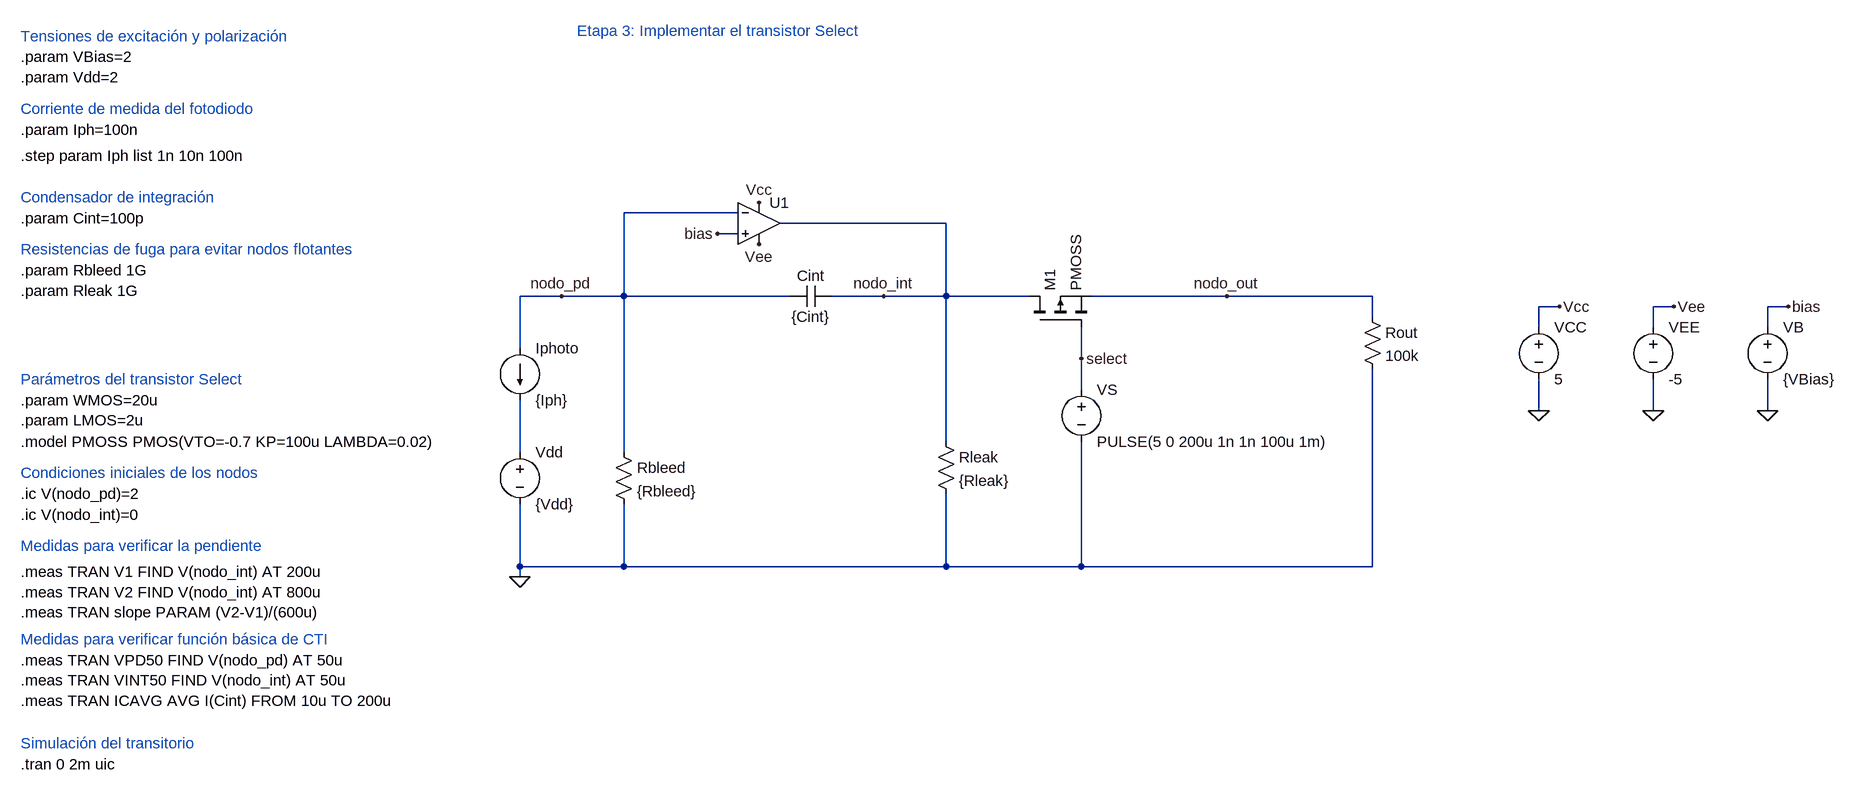
[diagram p0: schematic CTI_Etapa3.asc]
CTI_Etapa3.asc, the LTspice schematic file:
Version 4.1
SHEET 1 2360 1408
WIRE 416 384 240 384
WIRE 736 400 480 400
WIRE 416 416 384 416
WIRE 144 512 80 512
WIRE 240 512 240 384
WIRE 240 512 144 512
WIRE 496 512 240 512
WIRE 640 512 560 512
WIRE 736 512 736 400
WIRE 736 512 640 512
WIRE 864 512 736 512
WIRE 1168 512 960 512
WIRE 1392 512 1168 512
WIRE 1680 528 1648 528
WIRE 1856 528 1824 528
WIRE 2032 528 2000 528
WIRE 1392 544 1392 512
WIRE 1648 560 1648 528
WIRE 1824 560 1824 528
WIRE 2000 560 2000 528
WIRE 80 592 80 512
WIRE 944 608 944 560
WIRE 944 656 944 608
WIRE 1648 688 1648 640
WIRE 1824 688 1824 640
WIRE 2000 688 2000 640
WIRE 736 736 736 512
WIRE 80 752 80 672
WIRE 240 752 240 512
WIRE 80 928 80 832
WIRE 240 928 240 832
WIRE 240 928 80 928
WIRE 736 928 736 816
WIRE 736 928 240 928
WIRE 944 928 944 736
WIRE 944 928 736 928
WIRE 1392 928 1392 624
WIRE 1392 928 944 928
WIRE 80 944 80 928
FLAG 80 944 0
FLAG 144 512 nodo_pd
FLAG 640 512 nodo_int
FLAG 2032 528 bias
FLAG 1648 688 0
FLAG 1824 688 0
FLAG 1680 528 Vcc
FLAG 1856 528 Vee
FLAG 448 368 Vcc
FLAG 448 432 Vee
FLAG 384 416 bias
FLAG 2000 688 0
FLAG 944 608 select
FLAG 1168 512 nodo_out
SYMBOL voltage 2000 544 R0
SYMATTR InstName VB
SYMATTR Value {VBias}
SYMBOL current 80 592 R0
SYMATTR InstName Iphoto
SYMATTR Value {Iph}
SYMBOL cap 496 528 R270
WINDOW 0 32 32 VTop 2
WINDOW 3 0 32 VBottom 2
SYMATTR InstName Cint
SYMATTR Value {Cint}
SYMBOL res 224 736 R0
SYMATTR InstName Rbleed
SYMATTR Value {Rbleed}
SYMBOL res 720 720 R0
SYMATTR InstName Rleak
SYMATTR Value {Rleak}
SYMBOL voltage 80 736 R0
SYMATTR InstName Vdd
SYMATTR Value {Vdd}
SYMBOL OpAmps\\UniversalOpAmp2 448 400 R0
SYMATTR InstName U1
SYMBOL voltage 1648 544 R0
SYMATTR InstName VCC
SYMATTR Value 5
SYMBOL voltage 1824 544 R0
SYMATTR InstName VEE
SYMATTR Value -5
SYMBOL pmos 864 560 R270
SYMATTR InstName M1
SYMATTR Value PMOSS
SYMATTR SpiceLine L={LMOS} W={WMOS}
SYMBOL voltage 944 640 R0
SYMATTR InstName VS
SYMATTR Value PULSE(5 0 200u 1n 1n 100u 1m)
SYMBOL res 1376 528 R0
SYMATTR InstName Rout
SYMATTR Value 100k
TEXT 168 104 Left 2 ;Etapa 3: Implementar el transistor Select
TEXT -688 112 Left 2 ;Tensiones de excitación y polarización
TEXT -688 144 Left 2 !.param VBias=2\n.param Vdd=2
TEXT -688 224 Left 2 ;Corriente de medida del fotodiodo
TEXT -688 256 Left 2 !.param Iph=100n
TEXT -688 360 Left 2 ;Condensador de integración
TEXT -688 392 Left 2 !.param Cint=100p
TEXT -688 1232 Left 2 !.tran 0 2m uic
TEXT -688 1200 Left 2 ;Simulación del transitorio
TEXT -688 296 Left 2 !.step param Iph list 1n 10n 100n
TEXT -688 896 Left 2 ;Medidas para verificar la pendiente
TEXT -688 936 Left 2 !.meas TRAN V1 FIND V(nodo_int) AT 200u\n.meas TRAN V2 FIND V(nodo_int) AT 800u\n.meas TRAN slope PARAM (V2-V1)/(600u)
TEXT -688 440 Left 2 ;Resistencias de fuga para evitar nodos flotantes
TEXT -688 472 Left 2 !.param Rbleed 1G
TEXT -688 504 Left 2 !.param Rleak 1G
TEXT -688 736 Left 2 !.model PMOSS PMOS(VTO=-0.7 KP=100u LAMBDA=0.02)
TEXT -688 672 Left 2 !.param WMOS=20u\n.param LMOS=2u
TEXT -688 640 Left 2 ;Parámetros del transistor Select
TEXT -688 1040 Left 2 ;Medidas para verificar función básica de CTI
TEXT -688 1072 Left 2 !.meas TRAN VPD50 FIND V(nodo_pd) AT 50u\n.meas TRAN VINT50 FIND V(nodo_int) AT 50u\n.meas TRAN ICAVG AVG I(Cint) FROM 10u TO 200u
TEXT -688 784 Left 2 ;Condiciones iniciales de los nodos
TEXT -688 816 Left 2 !.ic V(nodo_pd)=2
TEXT -688 848 Left 2 !.ic V(nodo_int)=0

The netlist it stands for:
* CTI_Etapa3.asc
VB bias 0 {VBias}
Iphoto nodo_pd N001 {Iph}
Cint nodo_pd nodo_int {Cint}
Rbleed nodo_pd 0 {Rbleed}
Rleak nodo_int 0 {Rleak}
Vdd N001 0 {Vdd}
X§U1 bias nodo_pd Vcc Vee nodo_int level2 Avol=1Meg GBW=10Meg Slew=10Meg Ilimit=25m Rail=0 Vos=0 En=0 Enk=0 In=0 Ink=0 Rin=500Meg  ; pins In+ In- V+ V- OUT
VCC Vcc 0 5
VEE Vee 0 -5
M1 nodo_int select nodo_out nodo_out PMOSS L={LMOS} W={WMOS}
VS select 0 PULSE(5 0 200u 1n 1n 100u 1m)
Rout nodo_out 0 100k
.model NMOS NMOS
.model PMOS PMOS
.lib standard.mos
* Etapa 3: Implementar el transistor Select
* Tensiones de excitación y polarización
.param VBias=2
.param Vdd=2
* Corriente de medida del fotodiodo
.param Iph=100n
* Condensador de integración
.param Cint=100p
.tran 0 2m uic
* Simulación del transitorio
.step param Iph list 1n 10n 100n
* Medidas para verificar la pendiente
.meas TRAN V1 FIND V(nodo_int) AT 200u
.meas TRAN V2 FIND V(nodo_int) AT 800u
.meas TRAN slope PARAM (V2-V1)/(600u)
* Resistencias de fuga para evitar nodos flotantes
.param Rbleed 1G
.param Rleak 1G
.model PMOSS PMOS(VTO=-0.7 KP=100u LAMBDA=0.02)
.param WMOS=20u
.param LMOS=2u
* Parámetros del transistor Select
* Medidas para verificar función básica de CTI
.meas TRAN VPD50 FIND V(nodo_pd) AT 50u
.meas TRAN VINT50 FIND V(nodo_int) AT 50u
.meas TRAN ICAVG AVG I(Cint) FROM 10u TO 200u
* Condiciones iniciales de los nodos
.ic V(nodo_pd)=2
.ic V(nodo_int)=0
.lib UniversalOpAmp2.lib
.backanno
.end